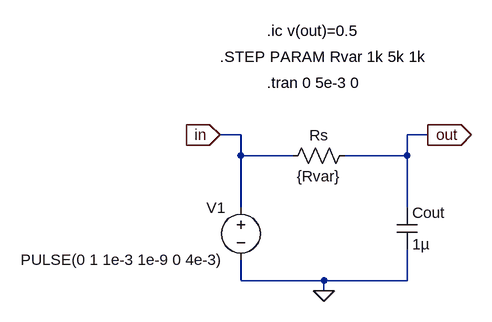
[diagram p0: schematic scarica_carica_condensatore.asc]
scarica_carica_condensatore.asc, the LTspice schematic file:
Version 4
SHEET 1 880 680
WIRE -224 -656 -256 -656
WIRE 64 -656 32 -656
WIRE -224 -624 -224 -656
WIRE -144 -624 -224 -624
WIRE 32 -624 32 -656
WIRE 32 -624 -64 -624
WIRE -224 -544 -224 -624
WIRE 32 -544 32 -624
WIRE -224 -432 -224 -464
WIRE -96 -432 -224 -432
WIRE 32 -432 32 -480
WIRE 32 -432 -96 -432
WIRE -96 -416 -96 -432
FLAG -96 -416 0
FLAG -256 -656 in
IOPIN -256 -656 In
FLAG 64 -656 out
IOPIN 64 -656 Out
SYMBOL voltage -224 -560 M0
WINDOW 123 0 0 Left 0
WINDOW 39 0 0 Left 0
SYMATTR InstName V1
SYMATTR Value PULSE(0 1 1e-3 1e-9 0 4e-3)
SYMBOL res -48 -640 R90
WINDOW 0 0 56 VBottom 2
WINDOW 3 32 56 VTop 2
SYMATTR InstName Rs
SYMATTR Value {Rvar}
SYMBOL cap 16 -544 R0
SYMATTR InstName Cout
SYMATTR Value 1µ
TEXT -184 -736 Left 2 !.tran 0 5e-3 0
TEXT -256 -776 Left 2 !.STEP PARAM Rvar 1k 5k 1k
TEXT -184 -816 Left 2 !.ic v(out)=0.5

The netlist it stands for:
* scarica_carica_condensatore.asc
V1 in 0 PULSE(0 1 1e-3 1e-9 0 4e-3)
Rs out in {Rvar}
Cout out 0 1µ
.tran 0 5e-3 0
.STEP PARAM Rvar 1k 5k 1k
.ic v(out)=0.5
.backanno
.end